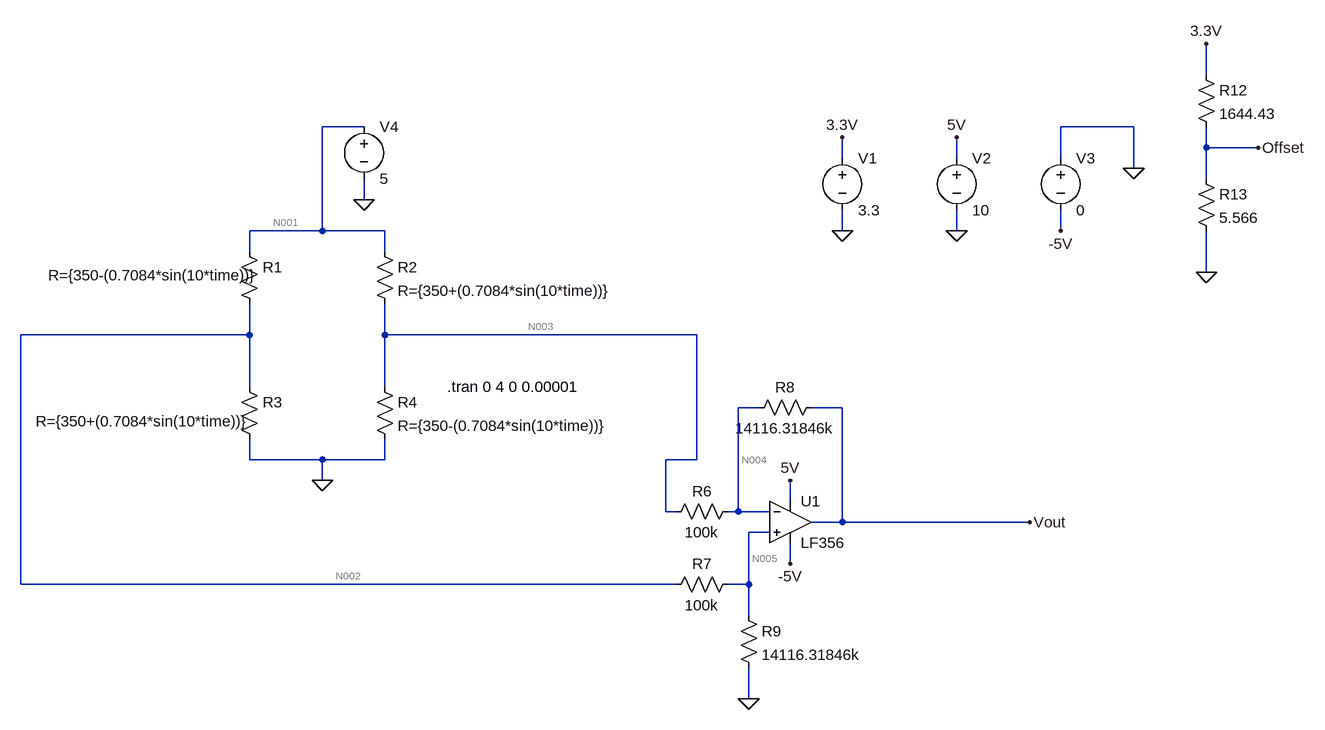
[diagram p0: schematic WheatstoneAndAmplifier - B.asc]
WheatstoneAndAmplifier - B.asc, the LTspice schematic file:
Version 4
SHEET 1 880 1060
WIRE 640 -48 640 -96
WIRE -656 32 -720 32
WIRE 528 32 416 32
WIRE 640 64 640 32
WIRE 720 64 640 64
WIRE 80 80 80 48
WIRE 256 80 256 48
WIRE 416 80 416 32
WIRE 528 96 528 32
WIRE 640 112 640 64
WIRE -656 144 -656 112
WIRE -720 192 -720 32
WIRE -720 192 -832 192
WIRE -624 192 -720 192
WIRE 80 192 80 160
WIRE 256 192 256 160
WIRE 416 192 416 160
WIRE -832 224 -832 192
WIRE -624 224 -624 192
WIRE 640 256 640 192
WIRE -832 352 -832 304
WIRE -832 352 -1184 352
WIRE -624 352 -624 304
WIRE -144 352 -624 352
WIRE -832 432 -832 352
WIRE -624 432 -624 352
WIRE -48 464 -80 464
WIRE 80 464 32 464
WIRE -832 544 -832 512
WIRE -720 544 -832 544
WIRE -624 544 -624 512
WIRE -624 544 -720 544
WIRE -144 544 -144 352
WIRE -144 544 -192 544
WIRE -720 576 -720 544
WIRE 0 608 0 576
WIRE -192 624 -192 544
WIRE -176 624 -192 624
WIRE -80 624 -80 464
WIRE -80 624 -96 624
WIRE -32 624 -80 624
WIRE 80 640 80 464
WIRE 80 640 32 640
WIRE 368 640 80 640
WIRE -32 656 -64 656
WIRE 0 704 0 672
WIRE -1184 736 -1184 352
WIRE -176 736 -1184 736
WIRE -64 736 -64 656
WIRE -64 736 -96 736
WIRE -64 784 -64 736
WIRE -64 912 -64 864
FLAG 80 192 0
FLAG 256 192 0
FLAG 80 48 3.3V
FLAG 256 48 5V
FLAG -720 576 0
FLAG 640 256 0
FLAG 640 -96 3.3V
FLAG 528 96 0
FLAG 416 192 -5V
FLAG 720 64 Offset
FLAG 0 576 5V
FLAG 0 704 -5V
FLAG -64 912 0
FLAG -656 144 0
FLAG 368 640 Vout
SYMBOL voltage 80 64 R0
WINDOW 123 0 0 Left 0
WINDOW 39 0 0 Left 0
SYMATTR InstName V1
SYMATTR Value 3.3
SYMBOL voltage 256 64 R0
WINDOW 123 0 0 Left 0
WINDOW 39 0 0 Left 0
SYMATTR InstName V2
SYMATTR Value 10
SYMBOL res -848 208 R0
WINDOW 3 -294 52 Left 2
SYMATTR Value R={350-(0.7084*sin(10*time))}
SYMATTR InstName R1
SYMBOL res -640 208 R0
SYMATTR InstName R2
SYMATTR Value R={350+(0.7084*sin(10*time))}
SYMBOL res -848 416 R0
WINDOW 3 -313 69 Left 2
SYMATTR Value R={350+(0.7084*sin(10*time))}
SYMATTR InstName R3
SYMBOL res -640 416 R0
SYMATTR InstName R4
SYMATTR Value R={350-(0.7084*sin(10*time))}
SYMBOL res 624 -64 R0
SYMATTR InstName R12
SYMATTR Value 1644.43
SYMATTR SpiceLine tol=5 pwr=.5
SYMBOL res 624 96 R0
SYMATTR InstName R13
SYMATTR Value 5.566
SYMATTR SpiceLine tol=5 pwr=.5
SYMBOL voltage 416 64 R0
WINDOW 123 0 0 Left 0
WINDOW 39 0 0 Left 0
SYMATTR InstName V3
SYMATTR Value 0
SYMBOL Opamps\\LF356 0 576 R0
SYMATTR InstName U1
SYMBOL res -80 608 R90
WINDOW 0 0 56 VBottom 2
WINDOW 3 32 56 VTop 2
SYMATTR InstName R6
SYMATTR Value 100k
SYMATTR SpiceLine tol=5 pwr=.5
SYMBOL res -80 720 R90
WINDOW 0 0 56 VBottom 2
WINDOW 3 32 56 VTop 2
SYMATTR InstName R7
SYMATTR Value 100k
SYMATTR SpiceLine tol=5 pwr=.5
SYMBOL res 48 448 R90
WINDOW 0 0 56 VBottom 2
WINDOW 3 32 56 VTop 2
SYMATTR InstName R8
SYMATTR Value 14116.31846k
SYMATTR SpiceLine tol=5 pwr=.5
SYMBOL res -80 768 R0
SYMATTR InstName R9
SYMATTR Value 14116.31846k
SYMATTR SpiceLine tol=5 pwr=.5
SYMBOL voltage -656 16 R0
WINDOW 123 0 0 Left 0
WINDOW 39 0 0 Left 0
SYMATTR InstName V4
SYMATTR Value 5
TEXT -528 432 Left 2 !.tran 0 4 0 0.00001

The netlist it stands for:
* WheatstoneAndAmplifier - B.asc
V1 3.3V 0 3.3
V2 5V 0 10
R1 N001 N002 R={350-(0.7084*sin(10*time))}
R2 N001 N003 R={350+(0.7084*sin(10*time))}
R3 N002 0 R={350+(0.7084*sin(10*time))}
R4 N003 0 R={350-(0.7084*sin(10*time))}
R12 3.3V Offset 1644.43 tol=5 pwr=.5
R13 Offset 0 5.566 tol=5 pwr=.5
V3 0 -5V 0
XU1 N005 N004 5V -5V Vout LF356  ; pins In+ In- V+ V- OUT
R6 N004 N003 100k tol=5 pwr=.5
R7 N005 N002 100k tol=5 pwr=.5
R8 Vout N004 14116.31846k tol=5 pwr=.5
R9 N005 0 14116.31846k tol=5 pwr=.5
V4 N001 0 5
.tran 0 4 0 0.00001
.lib LF356.sub
.backanno
.end

* Results of the author's LTspice run, read from the files saved beside the schematic
* Operating Point, zero values left out:
*   V(3.3v) = 3.3 V
*   V(5v) = 10 V
*   V(n001) = 5 V
*   V(n002) = 2.5 V
*   V(n003) = 2.5 V
*   V(offset) = 11.13 mV
*   V(n004) = 2.497 V
*   V(n005) = 2.482 V
*   V(vout) = 2.026 V
*   I(R4) = 7.143 mA
*   I(R3) = 7.143 mA
*   I(R2) = 7.143 mA
*   I(R1) = 7.143 mA
*   I(R9) = 175.9 nA
*   I(R8) = -33.36 nA
*   I(R7) = -175.5 nA
*   I(R6) = -33.14 nA
*   I(R13) = 2 mA
*   I(R12) = 2 mA
*   I(V4) = -14.29 mA
*   I(V3) = -4.836 mA
*   I(V2) = -4.836 mA
*   I(V1) = -2 mA
*   Ix(u1:1) = -380.4 pA
*   Ix(u1:2) = -219.2 pA
*   Ix(u1:99) = 4.836 mA
*   Ix(u1:50) = -4.836 mA
*   Ix(u1:28) = 33.36 nA